# Altium schematic sheet MCU103A_USB_and_Power.SchDoc
size 431 x 279 mm; Date: Not shown in title block; ApprovedBy: Not shown in title block; CheckedBy: Not shown in title block; Author: Not shown in title block; CompanyName: Not shown in title block; Engineer: Not shown in title block; Organization: Not shown in title block; Address1: Not shown in title block; Address2: Not shown in title block; Address3: Not shown in title block; Address4: Not shown in title block; DocumentNumber: 6; Revision: Use project parameter SCH_Rev; SheetNumber: 6; SheetTotal: 8; PageSetup: Record=PageOptions|CenterHorizontal=True|CenterVertical=True|PrintScale=1.00|XCorrection=1.00|YCorrection=1.00|PrintKind=0|BorderSize=5000000|LeftOffset=0|BottomOffset=0|Orientation=2|PaperLength=1000|PaperWidth=1000|Scale=100|PaperSource=15|PrintQuality=600|MediaType=1|DitherType=10|PaperKind=Letter|PrintScaleMode=1; CurrentTime: Not shown in title block; CurrentDate: Not shown in title block; Time: Not shown in title block; DocumentFullPathAndName: Not shown in title block; DocumentName: Not shown in title block; ModifiedDate: Not shown in title block; ImagePath: Not shown in title block
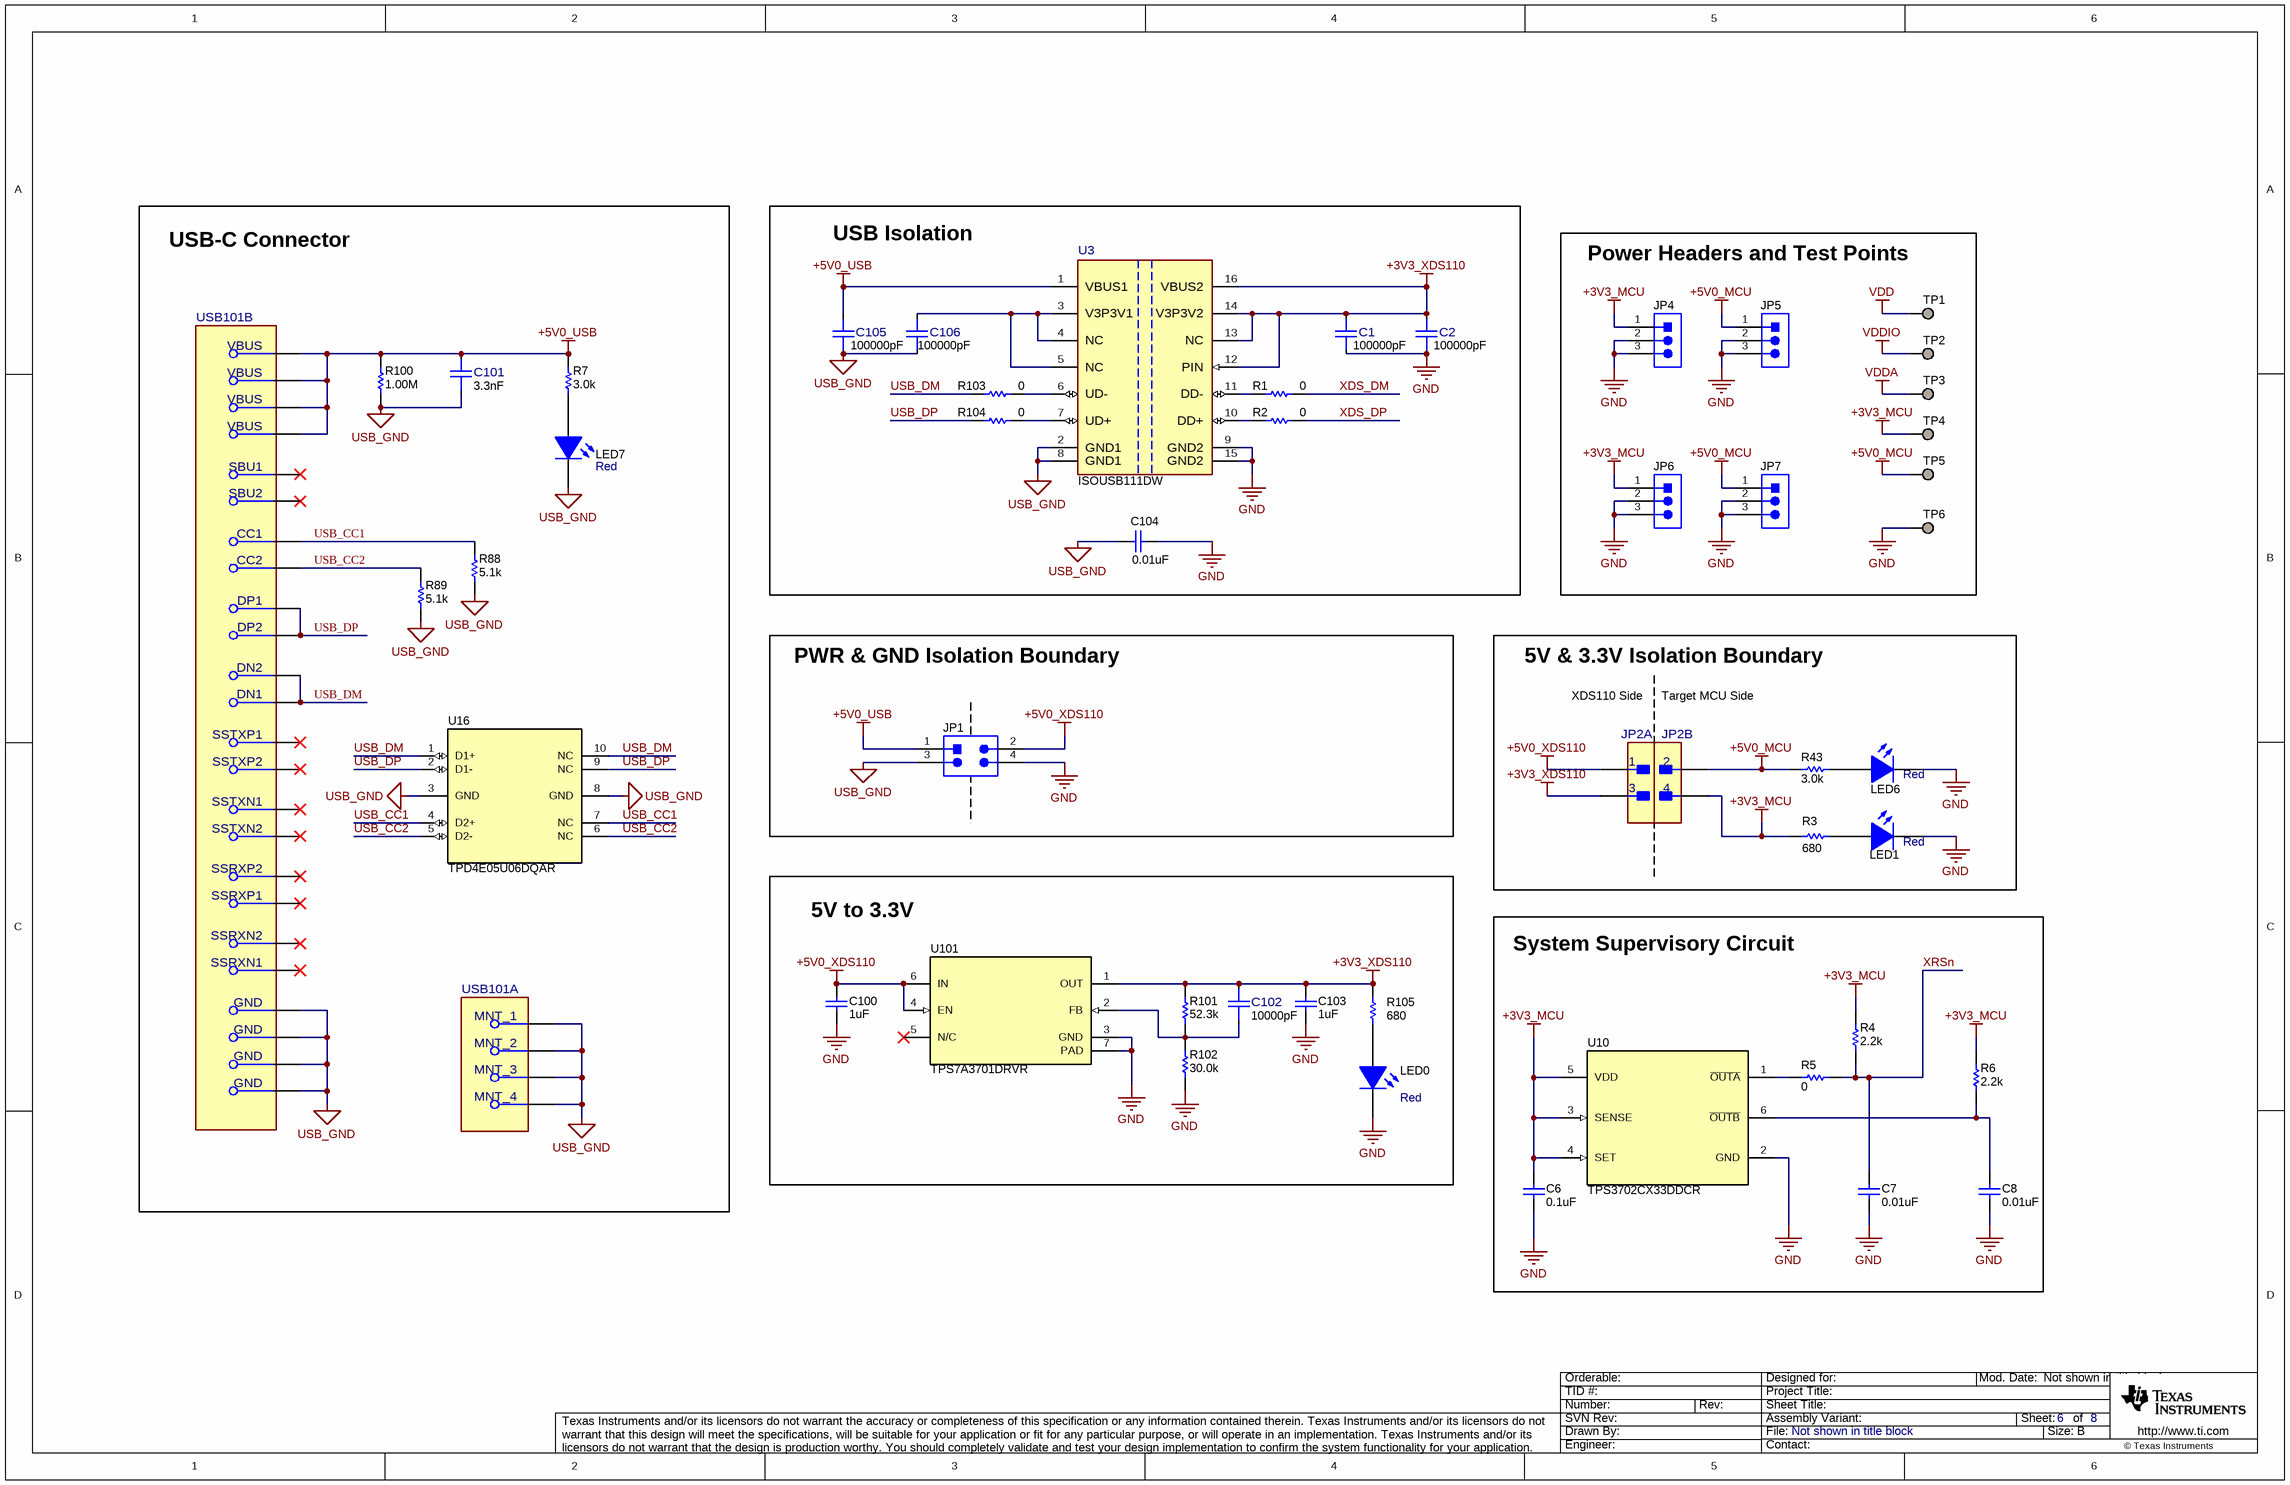
[diagram p0: MCU103A_USB_and_Power.SchDoc]

## Parts
C1  ValueDisplayed: 100000pF  [FP-885012205018_0402-MFG]  (hidden comment: 885012205018)
C2  ValueDisplayed: 100000pF  [FP-885012205018_0402-MFG]  (hidden comment: 885012205018)
C6  ValueDisplayed: 0.1uF  [0402]  (hidden comment: GRM155R71A104KA01D)
C7  ValueDisplayed: 0.01uF  [0402]  (hidden comment: GRM155R71E103KA01D)
C8  ValueDisplayed: 0.01uF  [0402]  (hidden comment: GRM155R71E103KA01D)
C100  ValueDisplayed: 1uF  [0402]  (hidden comment: 885012105012)
C101  ValueDisplayed: 3.3nF  [FP-885012205064_0402-MFG]  (hidden comment: 885012205064)
C102  ValueDisplayed: 10000pF  [FP-885012205050_0402-MFG]  (hidden comment: 885012205050)
C103  ValueDisplayed: 1uF  [0402]  (hidden comment: 885012105012)
C104  ValueDisplayed: 0.01uF  [1812]  (hidden comment: 1812SC103KAT1A)
C105  ValueDisplayed: 100000pF  [FP-885012205018_0402-MFG]  (hidden comment: 885012205018)
C106  ValueDisplayed: 100000pF  [FP-885012205018_0402-MFG]  (hidden comment: 885012205018)
JP1  TSM-102-01-L-DV  [Samtec_TSM-102-01-x-DV]  (value not drawn)
JP2  61300421121  [FP-61300421121_HDR4-MFG]  (value not drawn)  (parts A,B of 2)
JP4  61300311121  [WURTH_61300311121]  (value not drawn)
JP5  61300311121  [WURTH_61300311121]  (value not drawn)
JP6  61300311121  [WURTH_61300311121]  (value not drawn)
JP7  61300311121  [WURTH_61300311121]  (value not drawn)
LED0  value Red  [WL-SMCW_RED_0805]  (hidden comment: 150080SS75000)
LED1  value Red  [WL-SMCW_RED_0805]  (hidden comment: 150080SS75000)
LED6  value Red  [WL-SMCW_RED_0805]  (hidden comment: 150080SS75000)
LED7  value Red  [WL-SMCW_RED_0805]  (hidden comment: 150080SS75000)
R1  ValueDisplayed: 0  [0402]  (hidden comment: RC0402JR-070RL)
R2  ValueDisplayed: 0  [0402]  (hidden comment: RC0402JR-070RL)
R3  ValueDisplayed: 680  [0402]  (hidden comment: CRCW0402680RJNED)
R4  ValueDisplayed: 2.2k  [0402]  (hidden comment: CRCW04022K20JNED)
R5  ValueDisplayed: 0  [0402]  (hidden comment: CRCW04020000Z0ED)
R6  ValueDisplayed: 2.2k  [0603]  (hidden comment: CRCW06032K20JNEA)
R7  ValueDisplayed: 3.0k  [0603]  (hidden comment: RC0603JR-073KL)
R43  ValueDisplayed: 3.0k  [0603]  (hidden comment: RC0603JR-073KL)
R88  ValueDisplayed: 5.1k  [0603]  (hidden comment: RC0603JR-075K1L)
R89  ValueDisplayed: 5.1k  [0603]  (hidden comment: RC0603JR-075K1L)
R100  ValueDisplayed: 1.00M  [0402]  (hidden comment: CRCW04021M00FKED)
R101  ValueDisplayed: 52.3k  [0402]  (hidden comment: CRCW040252K3FKED)
R102  ValueDisplayed: 30.0k  [0402]  (hidden comment: CRCW040230K0FKED)
R103  ValueDisplayed: 0  [0402]  (hidden comment: RC0402JR-070RL)
R104  ValueDisplayed: 0  [0402]  (hidden comment: RC0402JR-070RL)
R105  ValueDisplayed: 680  [0402]  (hidden comment: CRCW0402680RJNED)
TP1  TESTPOINT  [TP_50MIL-25MILHOLE]  (value not drawn)  (no BOM)
TP2  TESTPOINT  [TP_50MIL-25MILHOLE]  (value not drawn)  (no BOM)
TP3  TESTPOINT  [TP_50MIL-25MILHOLE]  (value not drawn)  (no BOM)
TP4  TESTPOINT  [TP_50MIL-25MILHOLE]  (value not drawn)  (no BOM)
TP5  TESTPOINT  [TP_50MIL-25MILHOLE]  (value not drawn)  (no BOM)
TP6  TESTPOINT  [TP_50MIL-25MILHOLE]  (value not drawn)  (no BOM)
U3  ISOUSB111DW  [DW0016B-MFG]
U10  TPS3702CX33DDCR  [DDC0006A_N]
U16  TPD4E05U06DQAR  [DQA0010A]
U101  TPS7A3701DRVR  [DRV0006A]
USB101  MUP-U22001  [FP-MUP-U22001_CONN_USB_8MM94_8MM0-MFG]  (value not drawn)  (parts A,B of 2)

## Blocks framed on the sheet
USB-C Connector: C101 LED7 R7 R88 R89 R100 U16 USB101
USB Isolation: C1 C2 C104-C106 R1 R2 R103 R104 U3
Power Headers and Test Points: JP4-JP7 TP1-TP6
PWR & GND Isolation Boundary: JP1
5V & 3.3V Isolation Boundary: JP2 LED1 LED6 R3 R43
5V to 3.3V: C100 C102 C103 LED0 R101 R102 R105 U101
System Supervisory Circuit: C6-C8 R4-R6 U10

## Nets
+3V3_MCU: C6.2 JP2.4 JP4.1 JP6.1 R3.2 R4.2 R6.2 TP4.1 U10.3(SENSE) U10.4(SET) U10.5(VDD)
+3V3_XDS110: C1.2 C2.2 C102.2 C103.1 JP2.3 R101.2 R105.2 U3.12(PIN) U3.13(NC) U3.14(V3P3V2) U3.16(VBUS2) U101.1(OUT)
+5V0_MCU: JP2.2 JP5.1 JP7.1 R43.2 TP5.1
+5V0_USB: C101.2 C105.2 JP1.1 R7.2 R100.2 U3.1(VBUS1) USB101.A4(VBUS) USB101.A9(VBUS) USB101.B4(VBUS) USB101.B9(VBUS)
+5V0_XDS110: C100.1 JP1.2 JP2.1 U101.4(EN) U101.6(IN)
GND: C1.1 C2.1 C6.1 C7.2 C8.2 C100.2 C103.2 C104.1 JP1.4 JP4.2 JP4.3 JP5.2 JP5.3 JP6.2 JP6.3 JP7.2 JP7.3 LED0.1(K) LED1.1(K) LED6.1(K) R102.1 TP6.1 U3.9(GND2) U3.15(GND2) U10.2(GND) U101.3(GND) U101.7(PAD)
USB_GND: C101.1 C104.2 C105.1 C106.1 JP1.3 LED7.1(K) R88.1 R89.1 R100.1 U3.2(GND1) U3.8(GND1) U16.3(GND) U16.8(GND) USB101.1(MNT_1) USB101.2(MNT_2) USB101.3(MNT_3) USB101.4(MNT_4) USB101.A1(GND) USB101.A12(GND) USB101.B1(GND) USB101.B12(GND)
VDD: TP1.1
VDDA: TP3.1
VDDIO: TP2.1
USB_CC1: R88.2 U16.4(D2+) U16.7(NC) USB101.A5(CC1)
USB_CC2: R89.2 U16.5(D2-) U16.6(NC) USB101.B5(CC2)
USB_DM: R103.1 U16.1(D1+) U16.10(NC) USB101.A7(DN1) USB101.B7(DN2)
USB_DP: R104.1 U16.2(D1-) U16.9(NC) USB101.A6(DP1) USB101.B6(DP2)
XDS_DM: R1.2
XDS_DP: R2.2
XRSn: C7.1 R4.1 R5.2
NetC8_1: C8.1 R6.1 U10.6(~{OUTB})
NetC102_1: C102.1 R101.1 R102.2 U101.2(FB)
NetC106_2: C106.2 U3.3(V3P3V1) U3.4(NC) U3.5(NC)
NetLED0_2: LED0.2(A) R105.1
NetLED1_2: LED1.2(A) R3.1
NetLED6_2: LED6.2(A) R43.1
NetLED7_2: LED7.2(A) R7.1
NetR1_1: R1.1 U3.11(DD-)
NetR2_1: R2.1 U3.10(DD+)
NetR5_1: R5.1 U10.1(~{OUTA})
NetR103_2: R103.2 U3.6(UD-)
NetR104_2: R104.2 U3.7(UD+)

Not connected (* = marked no-connect by the designer): U101 5(N/C)*; USB101 A2(SSTXP1)* A3(SSTXN1)* A8(SBU1)* A10(SSRXN2)* A11(SSRXP2)* B2(SSTXP2)* B3(SSTXN2)* B8(SBU2)* B10(SSRXN1)* B11(SSRXP1)*

## Notes on the sheet
- XDS110 Side
- Target MCU Side
- Drawn By:
- SVN Rev:
- Number:
- TID #:
- Orderable:
- Rev:
- Sheet Title:
- File:
- Project Title:
- Designed for:
- Assembly Variant:
- Mod. Date:
- Sheet:
- Size:
- of
- B
- http://www.ti.com
- Texas Instruments and/or its licensors do not warrant the accuracy or completeness of this specification or any information contained therein. Texas Instruments and/or its licensors do not warrant that this design will meet the specifications, will be suitable for your application or fit for any particular purpose, or will operate in an implementation. Texas Instruments and/or its licensors do not warrant that the design is production worthy. You should completely validate and test your design implementation to confirm the system functionality for your application.
- Engineer:
- Contact:
- © Texas Instruments

## Library data of the parts
C1 C2 C105 C106 = CMP-0090362-1: 0.1µF ±10% 10V Ceramic Capacitor X7R 0402 (1005 Metric); Manufacturer: Wurth Electronics; AEC Qualified: No; Value: 100nF; SizeZ_mm: 0.55mm; TempCo: 15%; RoHS: TRUE; Tolerance_%: 10%; datasheet: https://www.we-online.com/catalog/datasheet/885012205018.pdf; Lead Free: Yes; Operating Temperature Range: -55°C to +125°C; ComponentLink1Description: Datasheet; Digikey Description: CAP CER 0.1UF 10V X7R 0402; Supplier Part Number 1: 732-7513-1-ND; Supplier 2: Mouser; Mouser Part Number: 710-885012205018; Digikey Part Number: 732-7513-1-ND; Temperature Characteristic: X7R; Supplier 1: Digikey; Datasheet Path: datasheets/Cap-885012205018.pdf; ComponentLink1URL: https://www.we-online.com/catalog/datasheet/885012205018.pdf; VDC_V: 10V; Supplier Part Number 2: 710-885012205018; Cap_F: 100nF; PackageReference: 0402; PartNumber: 885012205018; Part Number: 885012205018; helpURL: https://upverter.com/upn/revision/1acbe355db19639d/
C6 = CMP-0006629-2: CAP, CERM, 0.1 uF, 10 V, +/- 10%, X7R, 0402; Manufacturer: MuRata; Polarized: N; Value: 0.1uF; U/M: EA; Cap_F: 100nF; Value1: Unknown; VDC_V: 10V; TaMin_C: -55°C; TaMax_C: 125°C; SizeArea_mm2: 0.5; SizeAreaWB_mm2: 3; SizeX_mm: 1; SizeZ_mm: 0.6; AEC Category: Q200; CompType: Capacitor; PartNumber: GRM155R71A104KA01D; PackageReference: 0402; RoHS: Y; Tolerance_%: 10%; Value2: 10V; MountType: SMT; Technology: Ceramic; TempCo: X7R; Cap_Case: 0402; SizeY_mm: 0.5; Published: 2008-06-19; Publisher: Texas Instruments; LatestRevisionDate: 2017-03-09; ComponentLink1Description: Datasheet link; ComponentLink1URL: http://search.murata.co.jp/Ceramy/PnsearchViewAction.do?HnOFG=ON&HnNFG=ON&SEL_CNT=50&sLang=en&sKey=GRM155R71A104KA01D&x=9&y=9&search=startwith; Supplier 1: Digi-Key; Supplier Part Number 1: GRM155R71A104KA01D-ND; Supplier 2: Newark; Supplier Part Number 2: 14T3278; Supplier 3: Mouser; Supplier Part Number 3: 81-GRM155R71A104KA1D; AEC Qualified: ?
C7 C8 = CMP-0006658-2: CAP, CERM, 0.01 uF, 25 V, +/- 10%, X7R, 0402; Manufacturer: MuRata; Polarized: N; Value: 0.01uF; U/M: EA; Cap_F: 10nF; Value1: Unknown; VDC_V: 25V; TaMin_C: -55°C; TaMax_C: 125°C; SizeArea_mm2: 0.5; SizeAreaWB_mm2: 3; SizeX_mm: 1; SizeZ_mm: 0.6; AEC Category: Q200; CompType: Capacitor; PartNumber: GRM155R71E103KA01D; PackageReference: 0402; RoHS: Y; Tolerance_%: 10%; Value2: 25V; MountType: SMT; Technology: Ceramic; TempCo: X7R; Cap_Case: 0402; SizeY_mm: 0.5; Published: 2008-06-19; Publisher: Texas Instruments; LatestRevisionDate: 2017-03-09; ComponentLink1Description: Datasheet link; ComponentLink1URL: http://search.murata.co.jp/Ceramy/PnsearchViewAction.do?HnOFG=ON&HnNFG=ON&SEL_CNT=50&sLang=en&sKey=GRM155R71E103KA01D&x=9&y=9&search=startwith; Supplier 1: Digi-Key; Supplier Part Number 1: 490-1312-1-ND; Supplier 2: Mouser; Supplier Part Number 2: 81-GRM36X103K25; Supplier 3: Farnell; Supplier Part Number 3: 8819734; AEC Qualified: ?
C100 C103 = CMP-0064924-2: CAP, CERM, 1 uF, 10 V,+/- 20%, X5R, 0402; Manufacturer: Wurth Elektronik; Polarized: N; Value: 1uF; U/M: EA; Cap_F: 1µF; Value1: Unknown; VDC_V: 10V; TaMin_C: -55°C; TaMax_C: 85°C; SizeArea_mm2: 0.5; SizeAreaWB_mm2: 3; SizeX_mm: 1; SizeZ_mm: 0.6; AEC Category: Q200; CompType: Capacitor; PartNumber: 885012105012; PackageReference: 0402; RoHS: Y; Tolerance_%: 20%; Value2: 10V; MountType: SMT; Technology: Ceramic; TempCo: X5R; Cap_Case: 0402; SizeY_mm: 0.5; Published: 2008-06-19; Publisher: Texas Instruments; LatestRevisionDate: 2017-06-05; ComponentLink1Description: Datasheet link; ComponentLink1URL: http://katalog.we-online.de/pbs/datasheet/885012105012.pdf; Supplier 1: Digi-Key; Supplier Part Number 1: 732-7489-1-ND; Supplier 2: Newark; Supplier Part Number 2: 75Y5997; Supplier 3: Mouser; Supplier Part Number 3: 710-885012105012; AEC Qualified: N; AEC Grade: N/A
C101 = CMP-0092424-1: Cap Cer 3300pF 50V X7R 0402; Manufacturer: Wurth Electronics; TempCo: 15%; AEC Qualified: No; Value: 3.3nF; SizeZ_mm: 0.55mm; Tolerance_%: 10%; Part Number: 885012205064; Supplier 2: Mouser; RoHS: TRUE; Lead Free: Yes; ComponentLink1Description: Datasheet; Cap_F: 3.3nF; Supplier 1: Digikey; Digikey Description: CAP CER 3300PF 50V X7R 0402; Digikey Part Number: 732-7559-1-ND; Temperature Characteristic: X7R; Operating Temperature Range: -55°C to +125°C; Supplier Part Number 2: 710-885012205064; Datasheet Path: datasheets/Cap-885012205064.pdf; datasheet: https://www.we-online.com/catalog/datasheet/885012205064.pdf; helpURL: https://upverter.com/upn/revision/78c7421d1fb19545/; Supplier Part Number 1: 732-7559-1-ND; Mouser Part Number: 710-885012205064; PackageReference: 0402; PartNumber: 885012205064; ComponentLink1URL: https://www.we-online.com/catalog/datasheet/885012205064.pdf; VDC_V: 50V
C102 = CMP-0090363-1: 10000pF ±10% 25V Ceramic Capacitor X7R 0402 (1005 Metric); Manufacturer: Wurth Electronics; SizeZ_mm: 0.55mm; Cap_F: 10nF; AEC Qualified: No; Value: 10nF; TempCo: 15%; Digikey Description: CAP CER 10000PF 25V X7R 0402; RoHS: TRUE; PackageReference: 0402; Lead Free: Yes; datasheet: https://www.we-online.com/catalog/datasheet/885012205050.pdf; Datasheet Path: datasheets/Cap-885012205050.pdf; Mouser Part Number: 710-885012205050; Operating Temperature Range: -55°C to +125°C; Supplier 1: Digikey; Part Number: 885012205050; ComponentLink1URL: https://www.we-online.com/catalog/datasheet/885012205050.pdf; Tolerance_%: 10%; Digikey Part Number: 732-7545-1-ND; Temperature Characteristic: X7R; Supplier Part Number 1: 732-7545-1-ND; helpURL: https://upverter.com/upn/revision/f9df62cb48b9b255/; PartNumber: 885012205050; Supplier 2: Mouser; ComponentLink1Description: Datasheet; Supplier Part Number 2: 710-885012205050; VDC_V: 25V
C104 = CMP-0009297-2: CAP, CERM, 0.01 uF, 1500 V, +/- 10%, X7R, 1812; Manufacturer: AVX; TaMin_C: -55°C; ESR_ohm: 0.05; Polarized: N; SizeAreaWB_mm2: 23.1; Value1: 0.05 ohm; U/M: EA; Value: 0.01uF; TaMax_C: 125°C; SizeZ_mm: 1.35; SizeX_mm: 4.5; SizeY_mm: 3.2; Value2: 1500V; SizeArea_mm2: 14.4; Cap_F: 10nF; VDC_V: 1.5kV; AEC Category: Q200; Supplier Part Number 2: 96M1562; Publisher: Texas Instruments; Supplier 2: Newark; Supplier Part Number 3: 581-1812SC103KAT1A; TempCo: X7R; Supplier 3: Mouser; Published: 2008-06-19; RoHS: Y; MountType: SMT; Supplier 1: Digi-Key; PackageReference: 1812; Tolerance_%: 10%; Cap_Case: 1812; CompType: Capacitor; LatestRevisionDate: 2017-03-09; PartNumber: 1812SC103KAT1A; AEC Qualified: N; ComponentLink1Description: Datasheet link; AEC Grade: N/A; Supplier Part Number 1: 478-4735-1-ND; Technology: Ceramic; ComponentLink1URL: http://datasheets.avx.com/AVX-HV_MLCC.pdf
JP1 = CMP-0055559-1: Header, 2.54mm, 2x2, Gold, SMT; Manufacturer: Samtec; CNHeader: TRUE; Shrouded: N; Gender: Male; Cert_CSA: Y; Voltage_V: 475V; Row_Count: 2; Pitch_mm: 2.54; CT: FALSE; ComponentLink1URL: http://suddendocs.samtec.com/catalog_english/tsm.pdf; ClassName: Header; Supplier Part Number 2: 27C2242; Publisher: Texas Instruments; Supplier 2: Newark; Supplier Part Number 3: 1803290; Color: Black; Supplier 3: Farnell; RoHS: Y; MountType: SMT; Supplier 1: Digi-Key; PackageReference: Header, 2.54mm, 2x2, SMT; PinCount: 4; CompType: Header; LatestRevisionDate: 26/05/2017; PartNumber: TSM-102-01-L-DV; Orientation: Vertical; ComponentLink1Description: Datasheet URL; Supplier Part Number 1: TSM-102-01-L-DV-ND; ContactFinish: Gold; Cert_UL: Y
JP2 = CMP-0092422-1: THT Vertical Pin Header WR-PHD, Pitch 2.54 mm, Dual Row, 4 pins; Manufacturer: Wurth Electronics; DUT-Pitch_mm: 2.54mm; SizeZ_mm: 8.89mm; Voltage_V: 250V; Conn Gender: Male; AEC Qualified: No; Row_Count: 2; ContactFinish: Gold; Conn Orientation: Straight; Current_A: 3A; Supplier Part Number 2: 710-61300421121; Supplier 1: Digikey; Mouser Part Number: 710-61300421121; Operating Temperature Range: -40°C to +105°C; ComponentLink1URL: https://www.we-online.com/catalog/datasheet/61300421121.pdf; Lead Free: Yes; PinCount: 4; Supplier Part Number 1: 732-5294-ND; Part Number: 61300421121; RoHS: TRUE; Digikey Part Number: 732-5294-ND; Is Female: no; Digikey Description: CONN HEADER VERT 4POS 2.54MM; datasheet: https://www.we-online.com/catalog/datasheet/61300421121.pdf; PartNumber: 61300421121; Supplier 2: Mouser; Datasheet Path: datasheets/Conn-61300421121.pdf; PackageReference: HDR4; helpURL: https://upverter.com/upn/revision/de171c811246619e/; ComponentLink1Description: Datasheet
JP4-JP7 = CMP-0054796-1: Header, 2.54 mm, 3x1, Gold, TH; Manufacturer: Wurth Elektronik; Green_Lifecycle: Active; Green_REACh: Passed; CNHeader: TRUE; CT: FALSE; PartNumber: 61300311121; PackageReference: Header, 2.54mm, 3x1, TH; ClassName: Header; CompType: Header; RoHS: Y; MountType: TH; ComponentLink1Description: Datasheet URL; ComponentLink1URL: http://katalog.we-online.de/em/datasheet/6130xx11121.pdf; Publisher: Texas Instruments; LatestRevisionDate: 26/05/2017; Supplier 1: Digi-Key; Supplier Part Number 1: 732-5316-ND; Supplier 2: Newark; Supplier Part Number 2: 20X0950; Supplier 3: Farnell; Supplier Part Number 3: 356154; Green_EU RoHS: Passed; Green_EU RoHS-2: Incomplete
LED0 LED1 LED6 LED7 = CMP-0002951-3: LED, Red, SMD; Manufacturer: Wurth Elektronik; Type: AlInGaP; Vf_V: 1.9V; Io_A: 30mA; Vr_V: 5V; Ir_A: 25µA; Tjmax_C: 85°C; Power_TotalModule: 72mW; Value1: 0.072W; Angle: 140; CompType: LED; PartNumber: 150080SS75000; MountType: SMT; RoHS: Y; PackageReference: LED_0805; Value2: 1.9V; Color: Red; ComponentLink1URL: http://katalog.we-online.de/led/datasheet/150080SS75000.pdf; ComponentLink1Description: Datasheet link
R1 R2 R103 R104 = CMP-0027004-2: RES, 0, 5%, 0.063 W, 0402; Manufacturer: Yageo America; Power_W: 63mW; TempCo: 200 ppm/C; Value_Code: 0000; U/M: EA; Value: 0; EIA_Code: E24; SizeX_mm: 1; SizeY_mm: 0.5; SizeZ_mm: 0.6; Value2: 0.063W; VDC_V: 50V; AEC Category: Q200; Supplier Part Number 2: 603-RC0402JR-070RL; Publisher: Texas Instruments; Supplier 2: Mouser; Supplier Part Number 3: 9232516; Supplier 3: Farnell; Published: 2008-06-26; RoHS: Y; Value1: 5%; MountType: SMT; Supplier 1: Digi-Key; PackageReference: 0402; Tolerance_%: 5%; Res_ohm: 0; SizeArea_mm2: 0.5; CompType: Resistor; LatestRevisionDate: 2017-03-09; PartNumber: RC0402JR-070RL; AEC Qualified: ?; ComponentLink1Description: Datasheet link; Supplier Part Number 1: 311-0.0JRCT-ND; Technology: Thick Film; ComponentLink1URL: http://www.yageo.com/pdf/Pu-RC0402_51_PbFree_L_2.pdf
R3 R105 = CMP-0026962-3: RES, 680, 5%, 0.063 W, AEC-Q200 Grade 0, 0402; Manufacturer: Vishay-Dale; Power_W: 63mW; TempCo: 200 ppm/C; Value_Code: 680R; Value: 680; EIA_Code: E24; SizeX_mm: 1; SizeY_mm: 0.5; SizeZ_mm: 0.6; Value2: 0.063W; AEC Qualified: Y; VDC_V: 50V; AEC Category: Q200; AEC Grade: 0; Supplier Part Number 2: 59M6744; Supplier 2: Newark; Supplier Part Number 3: 71-CRCW0402J-680-E3; Supplier 3: Mouser; RoHS: E; Value1: 5%; MountType: SMT; Supplier 1: Digi-Key; PackageReference: 0402; Tolerance_%: 5%; Res_ohm: 680; SizeArea_mm2: 0.5; CompType: Resistor; PartNumber: CRCW0402680RJNED; ComponentLink1Description: Datasheet link; Supplier Part Number 1: 541-680JCT-ND; Technology: Thick Film; ComponentLink1URL: http://www.vishay.com/docs/20035/dcrcwe3.pdf
R4 = CMP-0026890-5: RES, 2.2 k, 5%, 0.063 W, AEC-Q200 Grade 0, 0402; Manufacturer: Vishay-Dale; Value: 2.2k; Value_Code: 2k20; Power_W: 63mW; Value2: 0.063W; VDC_V: 50V; TempCo: 200 ppm/C; SizeArea_mm2: 0.5; SizeX_mm: 1; SizeZ_mm: 0.6; EIA_Code: E24; AEC Category: Q200; AEC Qualified: Y; AEC Grade: 0; CompType: Resistor; PartNumber: CRCW04022K20JNED; PackageReference: 0402; RoHS: E; Res_ohm: 2.2k; Tolerance_%: 5%; Value1: 5%; MountType: SMT; Technology: Thick Film; SizeY_mm: 0.5; ComponentLink1Description: Datasheet link; ComponentLink1URL: http://www.vishay.com/docs/20035/dcrcwe3.pdf; Supplier 1: Digi-Key; Supplier Part Number 1: 541-2.2KJCT-ND; Supplier 2: Newark; Supplier Part Number 2: 59M6710; Supplier 3: Mouser; Supplier Part Number 3: 71-CRCW0402J-2.2K-E3
R5 = CMP-0026822-3: RES, 0, 5%, 0.063 W, AEC-Q200 Grade 0, 0402; Manufacturer: Vishay-Dale; Value: 0; Value_Code: 0000; Power_W: 63mW; Value2: 0.063W; VDC_V: 50V; TempCo: 200 ppm/C; SizeArea_mm2: 0.5; SizeX_mm: 1; SizeZ_mm: 0.6; EIA_Code: E24; AEC Category: Q200; AEC Qualified: Y; CompType: Resistor; PartNumber: CRCW04020000Z0ED; PackageReference: 0402; RoHS: E; Res_ohm: 0; Tolerance_%: 5%; Value1: 5%; MountType: SMT; Technology: Thick Film; SizeY_mm: 0.5; ComponentLink1Description: Datasheet link; ComponentLink1URL: http://www.vishay.com/docs/20035/dcrcwe3.pdf; Supplier 1: Digi-Key; Supplier Part Number 1: 541-0.0JCT-ND; Supplier 2: Newark; Supplier Part Number 2: 52K6543; Supplier 3: Mouser; Supplier Part Number 3: 71-CRCW0402-0-E3; AEC Grade: 0
R6 = CMP-0025769-4: RES, 2.2 k, 5%, 0.1 W, AEC-Q200 Grade 0, 0603; Manufacturer: Vishay-Dale; Value: 2.2k; Value_Code: 2k20; Power_W: 100mW; Value2: 0.1W; VDC_V: 75V; TempCo: 200 ppm/C; SizeArea_mm2: 1.28; SizeX_mm: 1.6; SizeY_mm: 0.8; SizeZ_mm: 1; EIA_Code: E24; AEC Category: Q200; AEC Qualified: Y; AEC Grade: 0; CompType: Resistor; PartNumber: CRCW06032K20JNEA; PackageReference: 0603; RoHS: E; Res_ohm: 2.2k; Tolerance_%: 5%; Value1: 5%; MountType: SMT; Technology: Thick Film; ComponentLink1Description: Datasheet link; ComponentLink1URL: http://www.vishay.com/docs/20035/dcrcwe3.pdf; Supplier 1: Digi-Key; Supplier Part Number 1: 541-2.2KGCT-ND; Supplier 2: Newark; Supplier Part Number 2: 59M6776; Supplier 3: Farnell; Supplier Part Number 3: 1652868
R7 R43 = CMP-0025921-5: RES, 3.0 k, 5%, 0.1 W, 0603; Manufacturer: Yageo; Power_W: 100mW; TempCo: 100 ppm/C; Value_Code: 3k00; Value: 3.0k; EIA_Code: E24; Res_ohm: 3k; SizeX_mm: 1.6; SizeY_mm: 0.8; SizeZ_mm: 1; Value2: 0.1W; SizeArea_mm2: 1.28; AEC Qualified: N; VDC_V: 75V; AEC Category: Q200; SizeAreaWB_mm2: 4.68; Supplier Part Number 2: 603-RC0603JR-073KL; Supplier 2: Mouser; Supplier Part Number 3: 1799415; Supplier 3: Farnell; RoHS: Y; Value1: 5%; MountType: SMT; Supplier 1: Digi-Key; PackageReference: 0603; Tolerance_%: 5%; CompType: Resistor; PartNumber: RC0603JR-073KL; ComponentLink1Description: Datasheet link; Supplier Part Number 1: 311-3.0KGRCT-ND; Technology: Thick Film; ComponentLink1URL: http://www.yageo.com/pdf/Pu-RC0603_51_PbFree_L_2.pdf; AEC Grade: N/A
R88 R89 = CMP-0025932-5: RES, 5.1 k, 5%, 0.1 W, 0603; Manufacturer: Yageo; Power_W: 100mW; TempCo: 100 ppm/C; Value_Code: 5k10; Value: 5.1k; EIA_Code: E24; SizeX_mm: 1.6; SizeY_mm: 0.8; SizeZ_mm: 1; Value2: 0.1W; SizeArea_mm2: 1.28; AEC Qualified: N; VDC_V: 75V; AEC Category: Q200; SizeAreaWB_mm2: 4.68; Supplier Part Number 2: 603-RC0603JR-075K1L; Supplier 2: Mouser; Supplier Part Number 3: 1799436; Supplier 3: Farnell; RoHS: Y; Value1: 5%; MountType: SMT; Supplier 1: Digi-Key; PackageReference: 0603; Tolerance_%: 5%; Res_ohm: 5.1k; CompType: Resistor; PartNumber: RC0603JR-075K1L; ComponentLink1Description: Datasheet link; Supplier Part Number 1: 311-5.1KGRCT-ND; Technology: Thick Film; ComponentLink1URL: http://www.yageo.com/pdf/Pu-RC0603_51_PbFree_L_2.pdf; AEC Grade: N/A
R100 = CMP-0026100-2: RES, 1.00 M, 1%, 0.063 W, AEC-Q200 Grade 0, 0402; Manufacturer: Vishay-Dale; Value: 1.00Meg; Res_ohm: 1M; Value_Code: 1M00; Power_W: 63mW; Value2: 0.063W; VDC_V: 50V; TempCo: 100 ppm/C; SizeArea_mm2: 0.5; SizeX_mm: 1; SizeZ_mm: 0.6; EIA_Code: E96; AEC Category: Q200; AEC Qualified: Y; AEC Grade: 0; CompType: Resistor; PartNumber: CRCW04021M00FKED; PackageReference: 0402; RoHS: E; Tolerance_%: 1%; Value1: 1%; MountType: SMT; Technology: Thick Film; SizeY_mm: 0.5; ComponentLink1Description: Datasheet link; ComponentLink1URL: http://www.vishay.com/docs/20035/dcrcwe3.pdf; Supplier 1: Digi-Key; Supplier Part Number 1: 541-1.00MLCT-ND; Supplier 2: Newark; Supplier Part Number 2: 52K6593; Supplier 3: Mouser; Supplier Part Number 3: 71-CRCW0402-1.0M-E3
R101 = CMP-0026441-2: RES, 52.3 k, 1%, 0.063 W, AEC-Q200 Grade 0, 0402; Manufacturer: Vishay-Dale; Power_W: 63mW; TempCo: 100 ppm/C; Value_Code: 52k3; Value: 52.3k; EIA_Code: E96; SizeX_mm: 1; SizeY_mm: 0.5; SizeZ_mm: 0.6; Value2: 0.063W; AEC Qualified: Y; VDC_V: 50V; AEC Category: Q200; AEC Grade: 0; ComponentLink1URL: http://www.vishay.com/docs/20035/dcrcwe3.pdf; Supplier Part Number 2: 52K7137; Supplier 2: Newark; Supplier Part Number 3: 71-CRCW0402-52.3K-E3; Supplier 3: Mouser; RoHS: E; Value1: 1%; MountType: SMT; Supplier 1: Digi-Key; PackageReference: 0402; Tolerance_%: 1%; Res_ohm: 52.3k; SizeArea_mm2: 0.5; CompType: Resistor; PartNumber: CRCW040252K3FKED; ComponentLink1Description: Datasheet link; Supplier Part Number 1: 541-52.3KLCT-ND; Technology: Thick Film
R102 = CMP-0078244-2: RES, 30.0 k, 1%, 0.063 W, AEC-Q200 Grade 0, 0402; Manufacturer: Vishay-Dale; Power_W: 63mW; Green_Lifecycle: Active; TempCo: 100 ppm/C; Value_Code: 30k0; Green_REACh: Passed; Value: 30.0k; Res_ohm: 30k; SizeX_mm: 1; SizeY_mm: 0.5; SizeZ_mm: 0.6; Value2: 0.063W; AEC Qualified: Y; VDC_V: 50V; AEC Grade: 0; AEC Category: Q200; ComponentLink1URL: http://www.vishay.com/docs/20035/dcrcwe3.pdf; Supplier Part Number 2: 52K6953; Supplier 2: Newark; Supplier Part Number 3: 71-CRCW0402-30K-E3; Supplier 3: Mouser; RoHS: E; Value1: 1%; MountType: SMT; Green_EU RoHS-2: Passed; Supplier 1: Digi-Key; Green_EU RoHS: Passed with Exemption; PackageReference: 0402; Tolerance_%: 1%; SizeArea_mm2: 0.5; CompType: Resistor; PartNumber: CRCW040230K0FKED; ComponentLink1Description: Datasheet link; Supplier Part Number 1: 541-30.0KLCT-ND; Technology: Thick Film
TP1-TP6 = CMP-0078143-3: TEST POINT.  No entry in BOM.; CompType: Testpoint; PackageReference: N/A; Manufacturer: N/A; PartNumber: N/A; Library Reference: TESTPOINT
U3 = CMP-0091303-1: Full/Low Speed Isolated USB Repeater, SOIC16-Wide; Manufacturer: Texas Instruments; Number Of Ports: 1; Usb Standard: USB 2.0; Min Supply Voltage: 3V; Data Rate: 12Mbits/s; Max Supply Voltage: 5.5V; TaMin_C: -40°C; SizeZ_mm: 2.65mm; TaMax_C: +125°C; Nominal Supply Current: 9-9.5mA; TJmax_C: +150°C; Standoff Height: 0.1mm; AEC Qualified: No; Part Number: ISOUSB111DW; Operating Temperature Range: -55°C to +150°C; PackageReference: SOICW16; Datasheet Path: datasheets/IC-ISOUSB111DW.pdf; Interface: USB; helpURL: https://upverter.com/upn/revision/bd93d5af0e7edffb/; RoHS: UNKNOWN; PartNumber: ISOUSB111DW
U10 = CMP-0067340-2: High-Accuracy, Fixed-Threshold OV/UV Monitor, DDC0006A (SOT-23-T-6); Alternate PartNumber: TPS3702CX33DDCT; Manufacturer: Texas Instruments; SizeArea_mm2: 4.8675; SizeAreaWB_mm2: 10.4675; SizeX_mm: 1.65; SizeY_mm: 2.95; SizeZ_mm: 0.87; CompType: IC; U/M: EA; PartNumber: TPS3702CX33DDCR; PackageReference: DDC0006A; PackageDescription: SOT-23-T-6; MountType: SMT; ComponentLink1Description: Datasheet Link; ComponentLink1URL: http://www.ti.com/lit/ds/symlink/tps3702.pdf; RoHS: Y; Publisher: Texas Instruments; LatestRevisionDate: 2017-06-09; Alternate Manufacturer: Texas Instruments
U16 = CMP-0073613-3: 4-Channel Ultra-Low-Capacitance IEC ESD Protection Diode, DQA0010A (USON-10); Alternate Manufacturer: Texas Instruments; Green_Lifecycle: Active; SizeAreaWB_mm2: 7.0; Green_REACh: Passed; SizeZ_mm: 0.55; SizeX_mm: 1.0; SizeY_mm: 2.5; CompType: IC; AEC Category: Q200; AEC Qualified: N; ComponentLink1URL: http://www.ti.com/lit/ds/symlink/tpd4e05u06.pdf; PackageDescription: USON-10; RoHS: Y; MountType: SMT; Green_EU RoHS-2: Passed; Manufacturer: Texas Instruments; Green_EU RoHS: Passed; PackageReference: DQA0010A; SizeArea_mm2: 2.5; PartNumber: TPD4E05U06DQAR; ComponentLink1Description: Datasheet Link; ComponentLink2Description: Product Folder; ComponentLink2URL: http://www.ti.com/product/tpd4e05u06; ComponentLink3Description: Online Datasheet; ComponentLink3URL: http://www.ti.com/product/tpd4e05u06/datasheet
U101 = CMP-0066914-5: 1% High-Accuracy, 1-A, Low-Dropout Regulator with Reverse Current Protection, DRV0006A (WSON-6); Manufacturer: Texas Instruments; Alternate PartNumber: TPS7A3701DRVT; SizeX_mm: 2; CompType: IC; SizeZ_mm: 0.8; SizeArea_mm2: 4; SizeAreaWB_mm2: 9; U/M: EA; PackageDescription: WSON-6; PartNumber: TPS7A3701DRVR; ComponentLink1URL: http://www.ti.com/lit/ds/symlink/tps7a3701.pdf; ComponentLink1Description: Datasheet Link; LatestRevisionDate: 2017-06-09; SizeY_mm: 2; Publisher: Texas Instruments; RoHS: Y; PackageReference: DRV0006A; MountType: SMT; Alternate Manufacturer: Texas Instruments
USB101 = CMP-0092137-1: Connector, USB Type-C 24 pin Mid Mount dual row Receptacle Surface Mount; Manufacturer: MUP; ContactFinish: Gold,Nickel; Usb Standard: OTHER; AEC Qualified: No; Conn Orientation: Horizontal; Shrouded: true; SizeZ_mm: 2.81mm; Is Female: yes; DUT-Pitch_mm: 0.5mm; Datasheet Path: datasheets/Conn-MUP-U22001.pdf; ComponentLink1URL: http://www.mupconnector.com/product/show/id/525.html; ComponentLink1Description: Datasheet; PartNumber: MUP-U22001; PackageReference: CONN_USB_8MM94_8MM0; helpURL: https://upverter.com/upn/revision/6b0c75e83cbd5706/; Part Number: MUP-U22001; RoHS: TRUE; datasheet: http://www.mupconnector.com/product/show/id/525.html; Lead Free: Yes; Operating Temperature Range: -25°C to +85°C; PinCount: 24